# Altium schematic sheet Sheet2.SchDoc
size A4
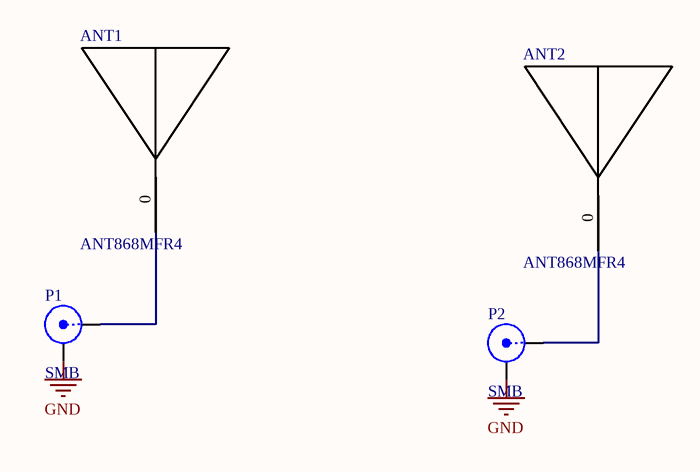
[diagram p0: Sheet2.SchDoc]

## Parts
ANT1  ANT868MFR4  [ANT2G4FR4]
ANT2  ANT868MFR4  [ANT2G4FR4]
P1  SMB  [SMB_V-RJ45]
P2  SMB  [SMB_V-RJ45]

## Nets
GND: P1.2(Y) P2.2(Y)
NetANT1_0: ANT1.0 P1.1(X)
NetANT2_0: ANT2.0 P2.1(X)

## Library data of the parts
P1 P2 = SMB: SMB Straight Connector; LatestRevisionDate: 17-Jul-2002; LatestRevisionNote: Re-released for DXP Platform.; Publisher: Altium Limited